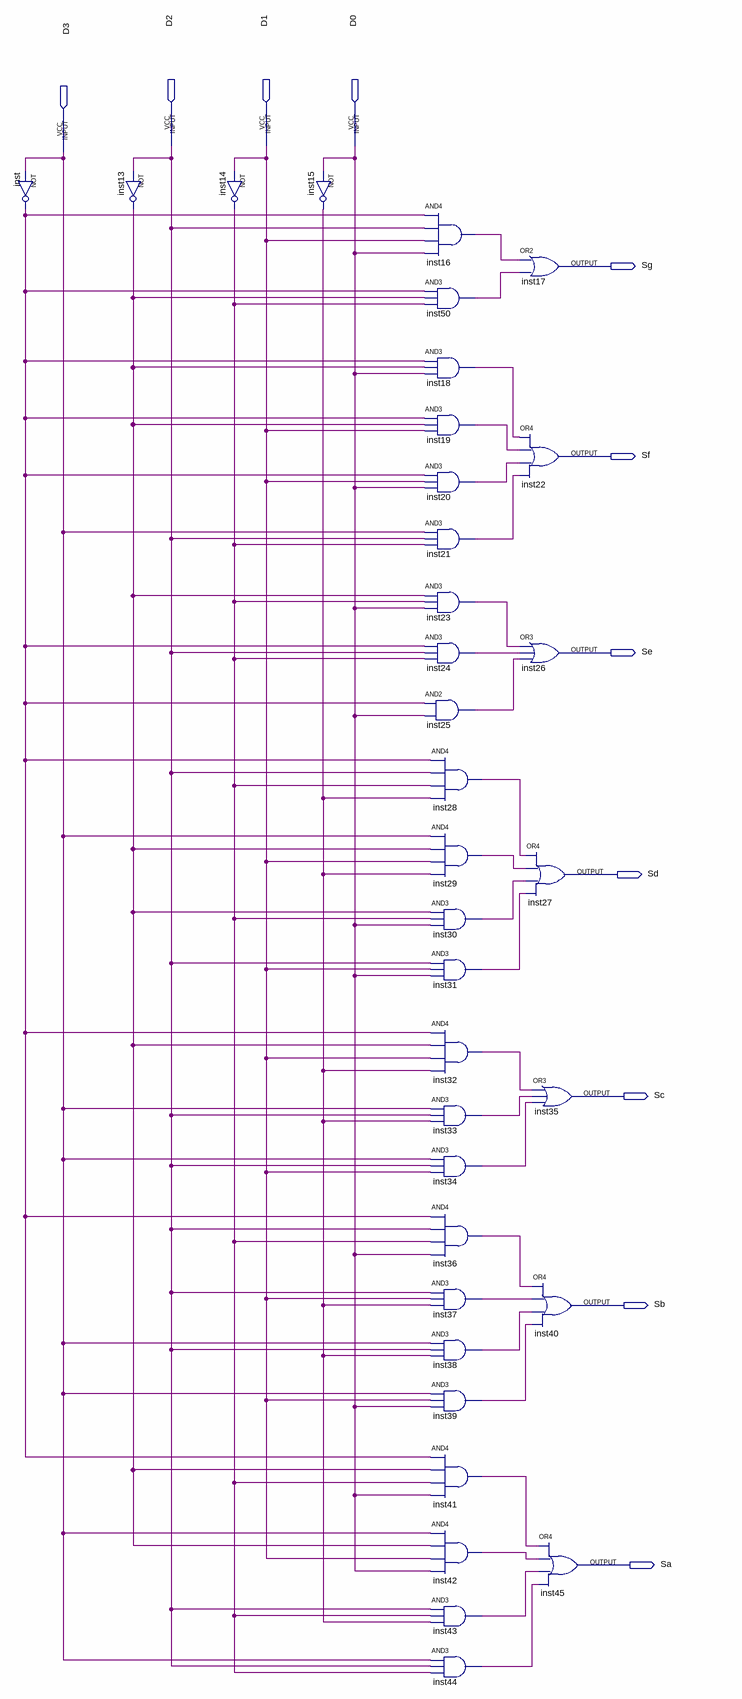
[diagram p0: schematic sheet]
// Quartus schematic Lab03_dd.bdf as structural Verilog: 35 symbols, 11 pins
module Lab03_dd (
  input  D2,
  input  D1,
  input  D0,
  input  D3,
  output Sg,
  output Sf,
  output Se,
  output Sd,
  output Sc,
  output Sb,
  output Sa
);

  wire inst13_out, inst14_out, inst15_out, inst16_out, inst18_out, inst19_out, inst20_out, inst21_out,
       inst23_out, inst24_out, inst25_out, inst28_out, inst29_out, inst30_out, inst31_out, inst32_out,
       inst33_out, inst34_out, inst36_out, inst37_out, inst38_out, inst39_out, inst41_out, inst42_out,
       inst43_out, inst44_out, inst50_out, inst_out;

  not inst (inst_out, D3);
  not inst13 (inst13_out, D2);
  not inst14 (inst14_out, D1);
  not inst15 (inst15_out, D0);
  and inst16 (inst16_out, inst_out, D2, D1, D0);
  and inst50 (inst50_out, inst_out, inst13_out, inst14_out);
  and inst18 (inst18_out, inst_out, inst13_out, D0);
  and inst19 (inst19_out, inst_out, inst13_out, D1);
  and inst20 (inst20_out, inst_out, D1, D0);
  and inst21 (inst21_out, D3, D2, inst14_out);
  and inst23 (inst23_out, inst13_out, inst14_out, D0);
  and inst24 (inst24_out, inst_out, D2, inst14_out);
  and inst25 (inst25_out, inst_out, D0);
  and inst28 (inst28_out, inst_out, D2, inst14_out, inst15_out);
  and inst29 (inst29_out, D3, inst13_out, D1, inst15_out);
  and inst30 (inst30_out, inst13_out, inst14_out, D0);
  and inst31 (inst31_out, D2, D1, D0);
  and inst32 (inst32_out, inst_out, inst13_out, D1, inst15_out);
  and inst33 (inst33_out, D3, D2, inst15_out);
  and inst34 (inst34_out, D3, D2, D1);
  and inst36 (inst36_out, inst_out, D2, inst14_out, D0);
  and inst37 (inst37_out, D2, D1, inst15_out);
  and inst38 (inst38_out, D3, D2, inst15_out);
  and inst39 (inst39_out, D3, D1, D0);
  and inst41 (inst41_out, inst_out, inst13_out, inst14_out, D0);
  and inst42 (inst42_out, D3, inst13_out, D1, D0);
  and inst43 (inst43_out, D2, inst14_out, inst15_out);
  and inst44 (inst44_out, D3, D2, inst14_out);
  or inst17 (Sg, inst16_out, inst50_out);
  or inst22 (Sf, inst18_out, inst19_out, inst20_out, inst21_out);
  or inst26 (Se, inst23_out, inst24_out, inst25_out);
  or inst27 (Sd, inst28_out, inst29_out, inst30_out, inst31_out);
  or inst35 (Sc, inst32_out, inst33_out, inst34_out);
  or inst40 (Sb, inst36_out, inst37_out, inst38_out, inst39_out);
  or inst45 (Sa, inst41_out, inst42_out, inst43_out, inst44_out);
endmodule
